# EAGLE design MSP430_6_8_19_REV1 (EAGLE 9.3.0)

## Sheet 1 of 2
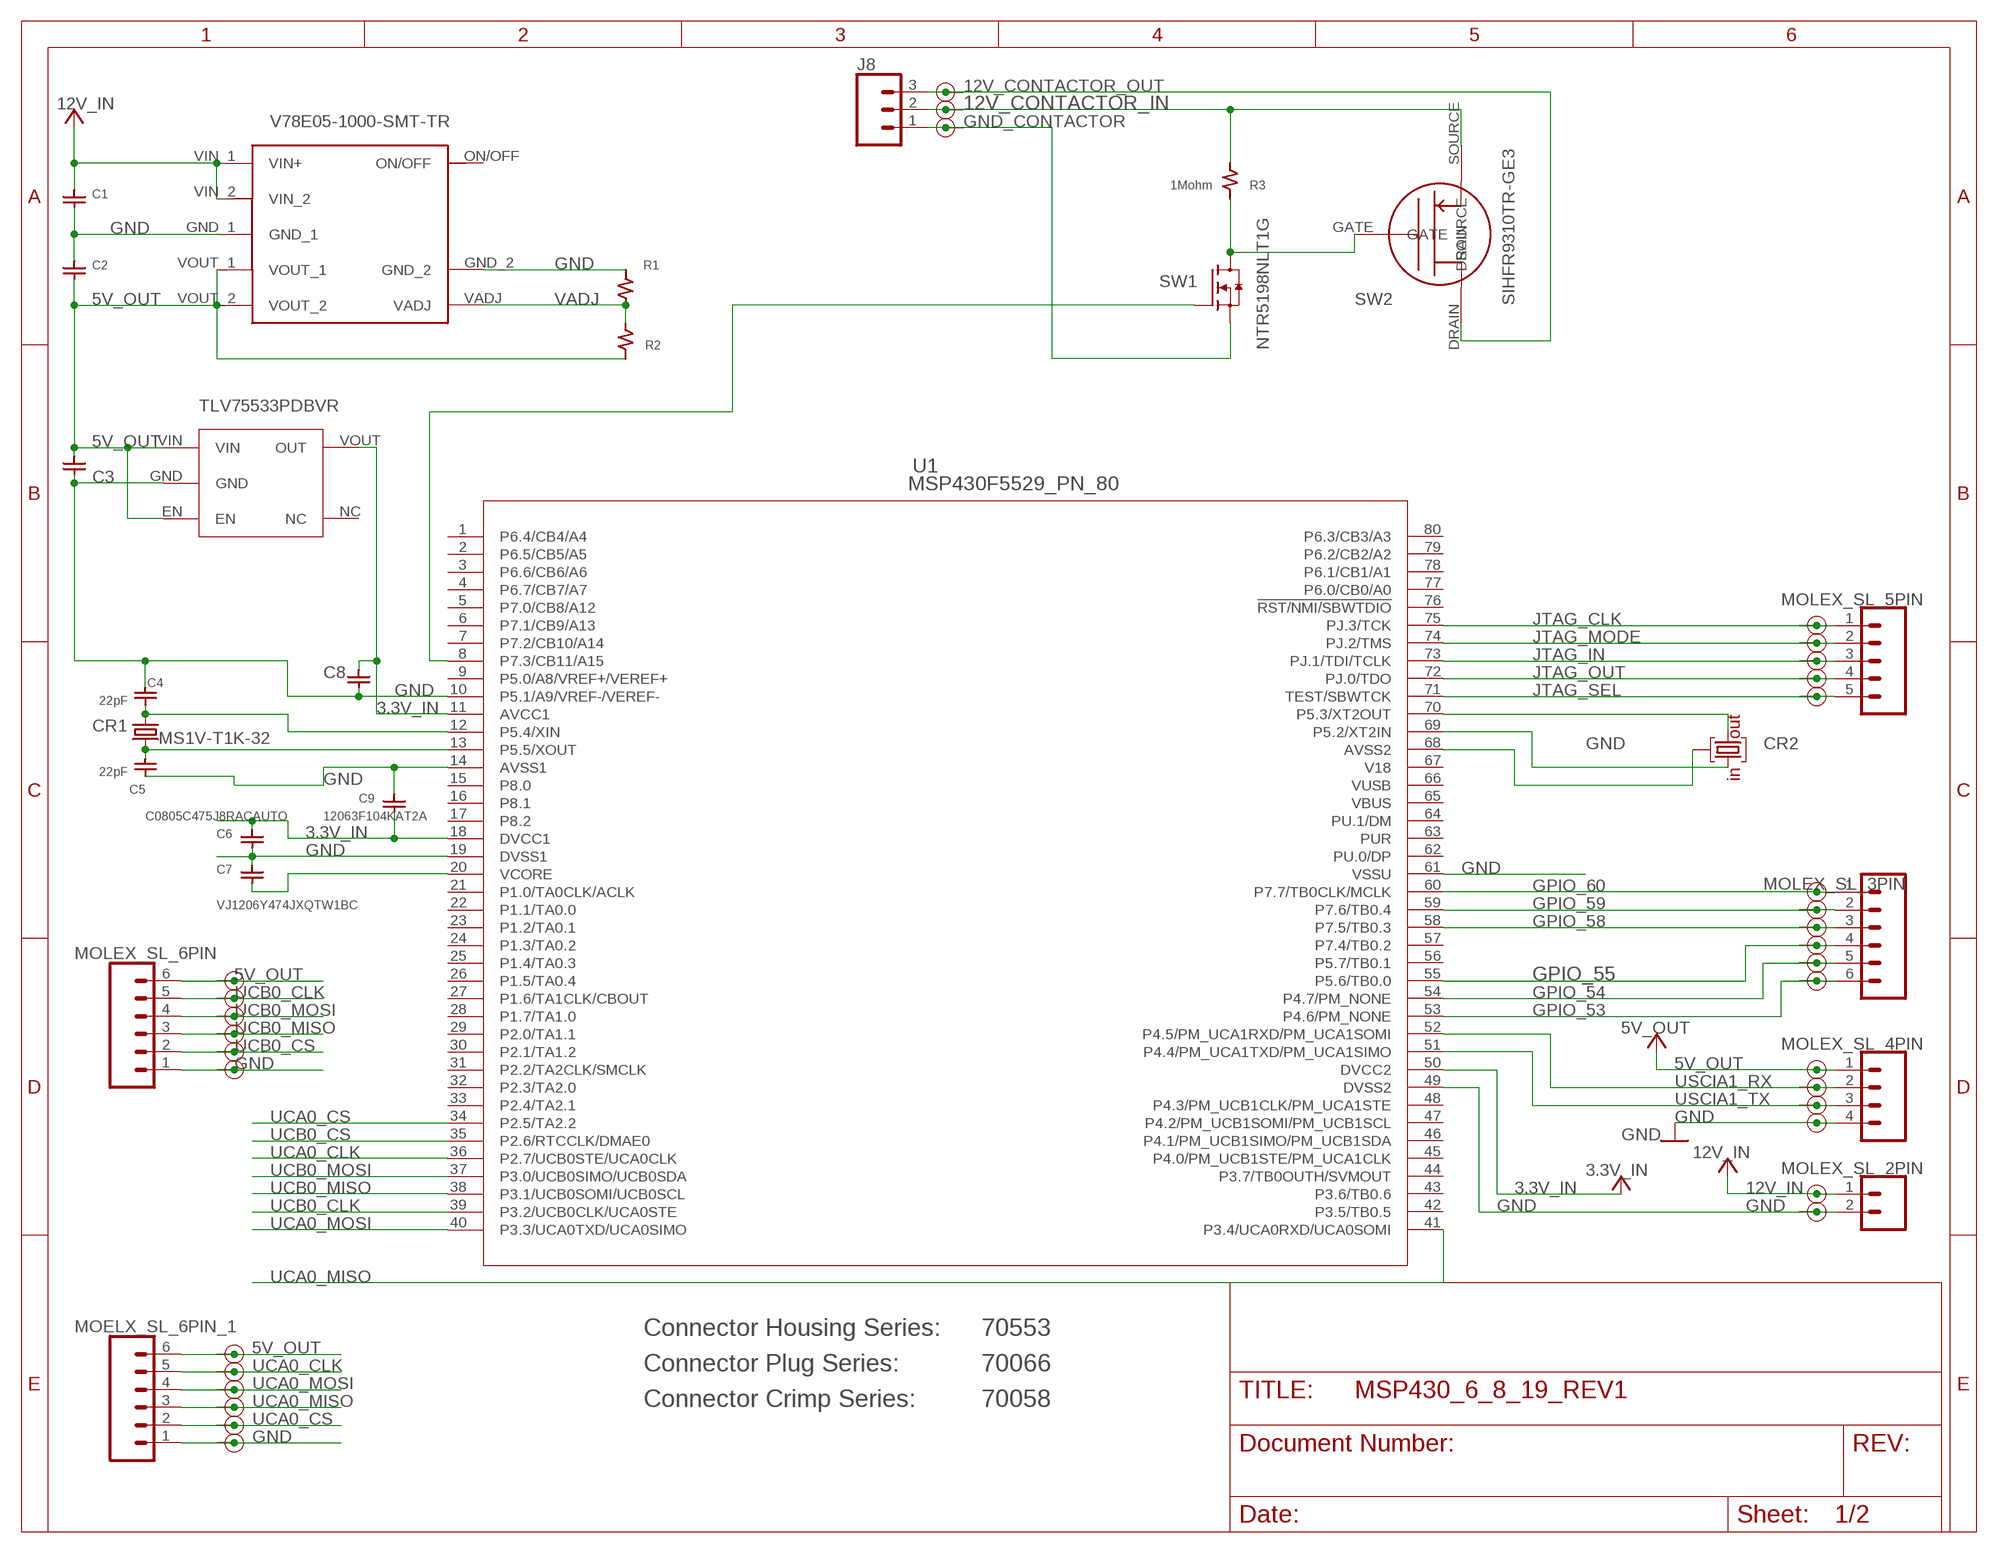
[diagram p0: schematic, sheet 1]

### Parts
C1  CGA5L1X7R1H106K160AC  [CGA5L1X7R1H106K160AC]
C2  C1206C226K8RACTU  [C1206C226K8RACTU]
C3  C0805C105J4RECTU  [C0805C105J4RECTU]
C4  22pF  C0805C220F5GACTUC0805C220F5GACTU  [C0805C220F5GACTU]
C5  22pF  C0805C220F5GACTUC0805C220F5GACTU  [C0805C220F5GACTU]
C6  C0805C475J8RACAUTO  [C0805C475J8RACAUTO]
C7  VJ1206Y474JXQTW1BC  [VJ1206Y474JXQTW1BC]
C8  C0805C105J4RECTU  [C0805C105J4RECTU]
C9  12063F104KAT2A  [12063F104KAT2A]
CR1  MS1V-T1K-32  [MS1V-T1K]
CR2  CSTCR4M00G53U-R0  [CSTCR4M00G53U-R0]
J8  CONN_03  [1X03]
MOELX_SL_6PIN_1  CONN_06SILK_FEMALE_PTH  [1X06]
MOLEX_SL_2PIN  CONN_02  [1X02]
MOLEX_SL_3PIN  CONN_06SILK_FEMALE_PTH  [1X06]
MOLEX_SL_4PIN  CONN_04  [1X04]
MOLEX_SL_5PIN  CONN_05  [1X05]
MOLEX_SL_6PIN  CONN_06SILK_FEMALE_PTH  [1X06]
PS1  V78E05-SMT-TR  [V78E05-1000-SMT-TR]
PS2  TLV75533PDBVR  [TLV75533PDBVR]
R1  RC2512FK-077K5L  [RC2512FK-077K5L]
R2  CRCW121043K0FKEAHP  [CRCW121043K0FKEAHP]
R3  1Mohm  THROUGHOLERESISTORCMF6023K000DHR6  [THROUGHHOLERESISTOR]
SW1  NTR5198NLT1G  [NTR5198NLT1G]
SW2  PMOS  [SIHFR9310TR-GE3]
U1  MSP430F5529_PN_80  [PN80]
U$10  HEADER_PIN_2.15/1.0  [2,15/1,0]
U$11  HEADER_PIN_2.15/1.0  [2,15/1,0]
U$12  HEADER_PIN_2.15/1.0  [2,15/1,0]
U$13  HEADER_PIN_2.15/1.0  [2,15/1,0]
U$14  HEADER_PIN_2.15/1.0  [2,15/1,0]
U$15  HEADER_PIN_2.15/1.0  [2,15/1,0]
U$16  HEADER_PIN_2.15/1.0  [2,15/1,0]
U$17  HEADER_PIN_2.15/1.0  [2,15/1,0]
U$18  HEADER_PIN_2.15/1.0  [2,15/1,0]
U$19  HEADER_PIN_2.15/1.0  [2,15/1,0]
U$20  HEADER_PIN_2.15/1.0  [2,15/1,0]
U$21  HEADER_PIN_2.15/1.0  [2,15/1,0]
U$22  HEADER_PIN_2.15/1.0  [2,15/1,0]
U$23  HEADER_PIN_2.15/1.0  [2,15/1,0]
U$24  HEADER_PIN_2.15/1.0  [2,15/1,0]
U$25  HEADER_PIN_2.15/1.0  [2,15/1,0]
U$26  HEADER_PIN_2.15/1.0  [2,15/1,0]
U$27  HEADER_PIN_2.15/1.0  [2,15/1,0]
U$28  HEADER_PIN_2.15/1.0  [2,15/1,0]
U$29  HEADER_PIN_2.15/1.0  [2,15/1,0]
U$30  HEADER_PIN_2.15/1.0  [2,15/1,0]
U$31  HEADER_PIN_2.15/1.0  [2,15/1,0]
U$32  HEADER_PIN_2.15/1.0  [2,15/1,0]
U$33  HEADER_PIN_2.15/1.0  [2,15/1,0]
U$34  HEADER_PIN_2.15/1.0  [2,15/1,0]
U$35  HEADER_PIN_2.15/1.0  [2,15/1,0]
U$36  HEADER_PIN_2.15/1.0  [2,15/1,0]
U$37  HEADER_PIN_2.15/1.0  [2,15/1,0]
U$38  HEADER_PIN_2.15/1.0  [2,15/1,0]
U$39  HEADER_PIN_2.15/1.0  [2,15/1,0]
U$40  HEADER_PIN_2.15/1.0  [2,15/1,0]
U$41  HEADER_PIN_2.15/1.0  [2,15/1,0]

### Nets
3.3V_IN: C6.2 C8.2 C9.1 PS2.VOUT(OUT) U1.11(AVCC1) U1.18(DVCC1) U1.50(DVCC2)
5V_OUT: C2.1 C3.2 MOELX_SL_6PIN_1.6 MOLEX_SL_4PIN.1 MOLEX_SL_6PIN.6 PS1.VOUT_1 PS1.VOUT_2 PS2.EN PS2.VIN R2.2 U$11.1 U$17.1 U$27.1 ; also sheet 2
12V_CONTACTOR_IN: J8.2 R3.1 SW2.SOURCE U$40.1
12V_CONTACTOR_OUT: J8.3 SW2.DRAIN U$39.1
12V_IN: C1.2 MOLEX_SL_2PIN.1 PS1.VIN_1(VIN+) PS1.VIN_2 U$23.1
GND: C1.1 C2.2 C3.1 C4.1 C5.2 C6.1 C7.2 C8.1 C9.2 CR2.GND MOELX_SL_6PIN_1.1 MOLEX_SL_2PIN.2 MOLEX_SL_4PIN.4 MOLEX_SL_6PIN.1 PS1.GND_1 PS1.GND_2 PS2.GND R1.2 U1.10(P5.1/A9/VREF-/VEREF-) U1.14(AVSS1) U1.19(DVSS1) U1.49(DVSS2) U1.61(VSSU) U1.68(AVSS2) U$10.1 U$16.1 U$22.1 U$24.1 ; also sheet 2
GND_CONTACTOR: J8.1 SW1.SOURCE U$41.1
GPIO_53: MOLEX_SL_3PIN.6 U1.53(P4.6/PM_NONE) U$28.1
GPIO_54: MOLEX_SL_3PIN.5 U1.54(P4.7/PM_NONE) U$29.1
GPIO_55: MOLEX_SL_3PIN.4 U1.55(P5.6/TB0.0) U$30.1
GPIO_58: MOLEX_SL_3PIN.3 U1.58(P7.5/TB0.3) U$31.1
GPIO_59: MOLEX_SL_3PIN.2 U1.59(P7.6/TB0.4) U$32.1
GPIO_60: MOLEX_SL_3PIN.1 U1.60(P7.7/TB0CLK/MCLK) U$33.1
JTAG_CLK: MOLEX_SL_5PIN.1 U1.75(PJ.3/TCK) U$38.1
JTAG_IN: MOLEX_SL_5PIN.3 U1.73(PJ.1/TDI/TCLK) U$36.1
JTAG_MODE: MOLEX_SL_5PIN.2 U1.74(PJ.2/TMS) U$37.1
JTAG_OUT: MOLEX_SL_5PIN.4 U1.72(PJ.0/TDO) U$35.1
JTAG_SEL: MOLEX_SL_5PIN.5 U1.71(TEST/SBWTCK) U$34.1
N$1: C7.1 U1.20(VCORE)
N$12: CR2.IN U1.69(P5.2/XT2IN)
N$13: CR2.OUT U1.70(P5.3/XT2OUT)
N$19: C4.2 CR1.P$2 U1.12(P5.4/XIN)
N$20: C5.1 CR1.P$3 U1.13(P5.5/XOUT)
N$30: R3.2 SW1.DRAIN SW2.GATE
N$31: SW1.GATE U1.8(P7.3/CB11/A15)
UCA0_CLK: MOELX_SL_6PIN_1.5 U1.36(P2.7/UCB0STE/UCA0CLK) U$18.1
UCA0_CS: MOELX_SL_6PIN_1.2 U1.34(P2.5/TA2.2) U$21.1
UCA0_MISO: MOELX_SL_6PIN_1.3 U1.41(P3.4/UCA0RXD/UCA0SOMI) U$20.1
UCA0_MOSI: MOELX_SL_6PIN_1.4 U1.40(P3.3/UCA0TXD/UCA0SIMO) U$19.1
UCB0_CLK: MOLEX_SL_6PIN.5 U1.39(P3.2/UCB0CLK/UCA0STE) U$12.1 ; also sheet 2
UCB0_CS: MOLEX_SL_6PIN.2 U1.35(P2.6/RTCCLK/DMAE0) U$15.1 ; also sheet 2
UCB0_MISO: MOLEX_SL_6PIN.3 U1.38(P3.1/UCB0SOMI/UCB0SCL) U$14.1 ; also sheet 2
UCB0_MOSI: MOLEX_SL_6PIN.4 U1.37(P3.0/UCB0SIMO/UCB0SDA) U$13.1 ; also sheet 2
USCIA1_RX: MOLEX_SL_4PIN.2 U1.52(P4.5/PM_UCA1RXD/PM_UCA1SOMI) U$26.1
USCIA1_TX: MOLEX_SL_4PIN.3 U1.51(P4.4/PM_UCA1TXD/PM_UCA1SIMO) U$25.1
VADJ: PS1.VADJ R1.1 R2.1
Unconnected: PS1.ON/OFF PS2.NC U1.1(P6.4/CB4/A4) U1.2(P6.5/CB5/A5) U1.3(P6.6/CB6/A6) U1.4(P6.7/CB7/A7) U1.5(P7.0/CB8/A12) U1.6(P7.1/CB9/A13) U1.7(P7.2/CB10/A14) U1.9(P5.0/A8/VREF+/VEREF+) U1.15(P8.0) U1.16(P8.1) U1.17(P8.2) U1.21(P1.0/TA0CLK/ACLK) U1.22(P1.1/TA0.0) U1.23(P1.2/TA0.1) U1.24(P1.3/TA0.2) U1.25(P1.4/TA0.3) U1.26(P1.5/TA0.4) U1.27(P1.6/TA1CLK/CBOUT) U1.28(P1.7/TA1.0) U1.29(P2.0/TA1.1) U1.30(P2.1/TA1.2) U1.31(P2.2/TA2CLK/SMCLK) U1.32(P2.3/TA2.0) U1.33(P2.4/TA2.1) U1.42(P3.5/TB0.5) U1.43(P3.6/TB0.6) U1.44(P3.7/TB0OUTH/SVMOUT) U1.45(P4.0/PM_UCB1STE/PM_UCA1CLK) U1.46(P4.1/PM_UCB1SIMO/PM_UCB1SDA) U1.47(P4.2/PM_UCB1SOMI/PM_UCB1SCL) U1.48(P4.3/PM_UCB1CLK/PM_UCA1STE) U1.56(P5.7/TB0.1) U1.57(P7.4/TB0.2) U1.62(PU.0/DP) U1.63(PUR) U1.64(PU.1/DM) U1.76(!RST/NMI/SBWTDIO) U1.77(P6.0/CB0/A0) U1.78(P6.1/CB1/A1) U1.79(P6.2/CB2/A2) U1.80(P6.3/CB3/A3)

### Notes on the sheet
- SW1
- SW2
- C3
- C8
- CR1
- CR2
- Connector Housing Series: | 70553
- Connector Plug Series: | 70066
- Connector Crimp Series: | 70058

## Sheet 2 of 2
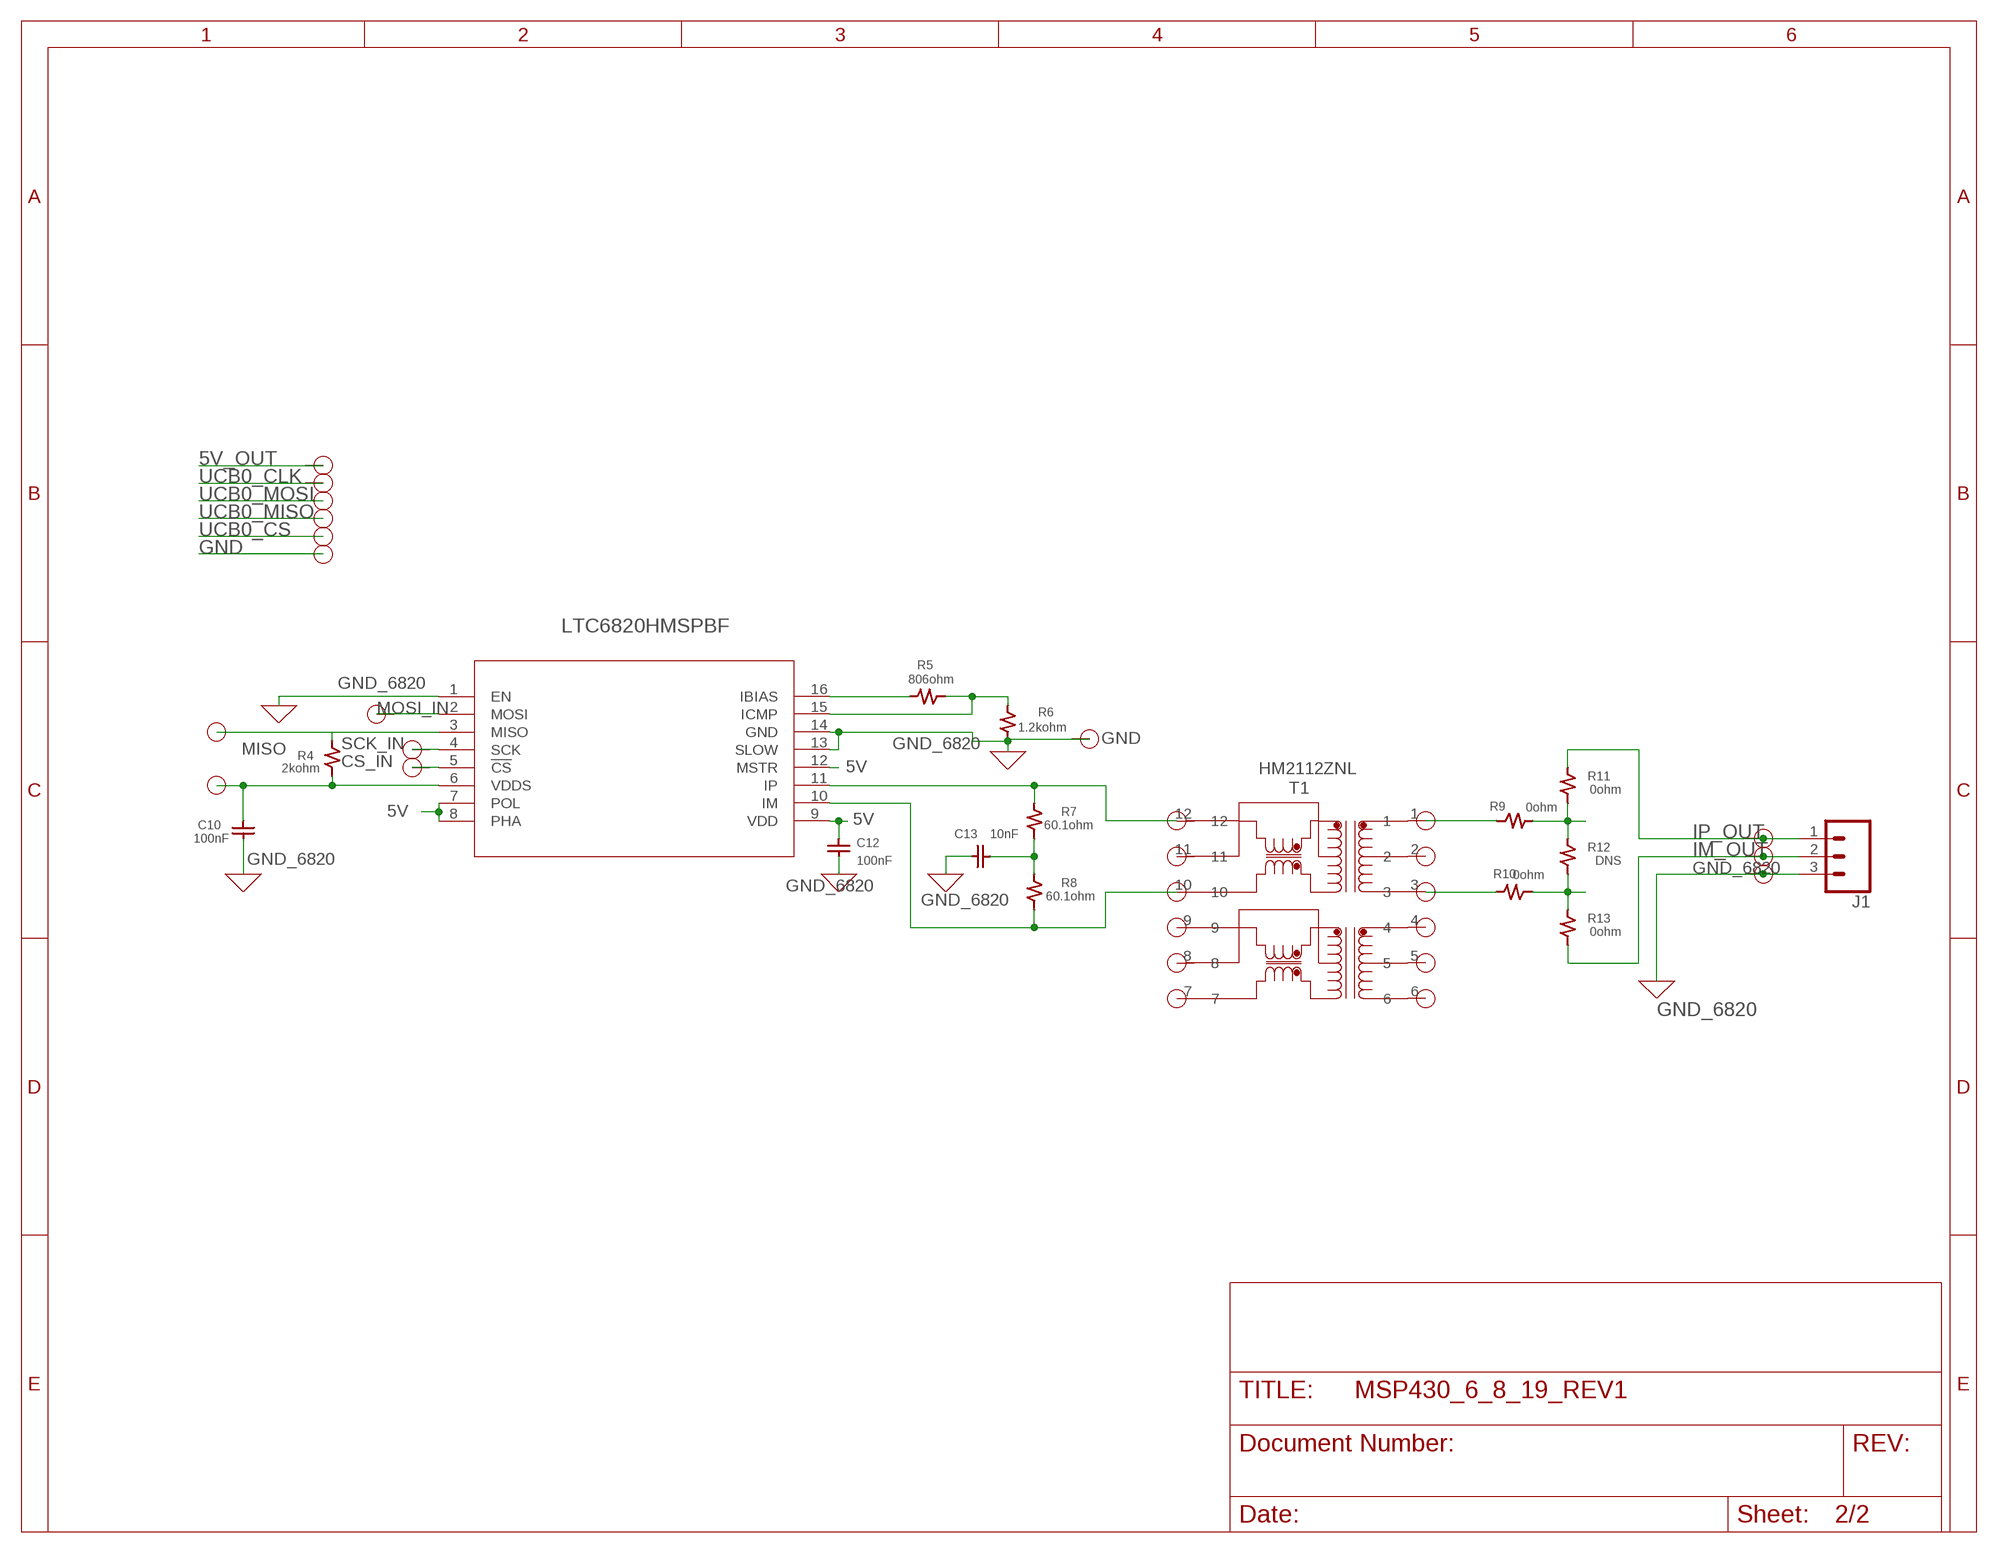
[diagram p1: schematic, sheet 2]

### Parts
+5V  HEADER_PIN_2.15/1.0  [2,15/1,0]
C10  100nF  0805_CAPACITOR  [0805_CAPACITOR]
C12  100nF  0805_CAPACITOR  [0805_CAPACITOR]
C13  10nF  0805_CAPACITOR  [0805_CAPACITOR]
CS  HEADER_PIN_2.15/1.0  [2,15/1,0]
GND  HEADER_PIN_2.15/1.0  [2,15/1,0]
J1  CONN_03  [1X03]
MISO  HEADER_PIN_2.15/1.0  [2,15/1,0]
MOSI  HEADER_PIN_2.15/1.0  [2,15/1,0]
R4  2kohm  0805_RESISTOR  [0805_RESISTOR]
R5  806ohm  0805_RESISTOR  [0805_RESISTOR]
R6  1.2kohm  0805_RESISTOR  [0805_RESISTOR]
R7  60.1ohm  0805_RESISTOR  [0805_RESISTOR]
R8  60.1ohm  0805_RESISTOR  [0805_RESISTOR]
R9  0ohm  0805_RESISTOR  [0805_RESISTOR]
R10  0ohm  0805_RESISTOR  [0805_RESISTOR]
R11  0ohm  0805_RESISTOR  [0805_RESISTOR]
R12  DNS  0805_RESISTOR  [0805_RESISTOR]
R13  0ohm  0805_RESISTOR  [0805_RESISTOR]
SCK  HEADER_PIN_2.15/1.0  [2,15/1,0]
T1  HM2112ZNL  [HM2112ZNL_12SMT]
U2  LTC6820HMSPBF  [MSOP-16_MS]
U$42  HEADER_PIN_2.15/1.0  [2,15/1,0]
U$43  HEADER_PIN_2.15/1.0  [2,15/1,0]
U$44  HEADER_PIN_2.15/1.0  [2,15/1,0]
U$45  HEADER_PIN_2.15/1.0  [2,15/1,0]
U$46  HEADER_PIN_2.15/1.0  [2,15/1,0]
U$47  HEADER_PIN_2.15/1.0  [2,15/1,0]
U$48  HEADER_PIN_2.15/1.0  [2,15/1,0]
U$49  HEADER_PIN_2.15/1.0  [2,15/1,0]
U$50  HEADER_PIN_2.15/1.0  [2,15/1,0]

### Nets
5V: +5V.1 C10.P$2 C12.P$2 R4.P$2 U2.6(VDDS) U2.7(POL) U2.8(PHA) U2.9(VDD) U2.12(MSTR)
5V_OUT: U$45.1 ; also sheet 1
CS_IN: CS.1 U2.5(!CS)
GND: U$50.1 ; also sheet 1
GND_6820: C10.P$1 C12.P$1 C13.P$1 GND.1 J1.3 R6.P$2 U2.1(EN) U2.13(SLOW) U2.14(GND) U$44.1 ; supply symbol labelled GND
IBIAS: R5.P$1 U2.16(IBIAS)
ICMP: R5.P$2 R6.P$1 U2.15(ICMP)
IM: R8.P$2 T1.10 U2.10(IM)
IM_OUT: J1.2 R13.P$2 U$43.1
IP: R7.P$1 T1.12 U2.11(IP)
IP_OUT: J1.1 R11.P$1 U$42.1
MISO_IN: MISO.1 R4.P$1 U2.3(MISO)
MOSI_IN: MOSI.1 U2.2(MOSI)
N$3: C13.P$2 R7.P$2 R8.P$1
N$11: R10.P$1 T1.3
N$21: R9.P$2 T1.1
N$40: R10.P$2 R12.P$2 R13.P$1
N$41: R9.P$1 R11.P$2 R12.P$1
SCK_IN: SCK.1 U2.4(SCK)
UCB0_CLK: U$46.1 ; also sheet 1
UCB0_CS: U$49.1 ; also sheet 1
UCB0_MISO: U$48.1 ; also sheet 1
UCB0_MOSI: U$47.1 ; also sheet 1
Unconnected: T1.2 T1.4 T1.5 T1.6 T1.7 T1.8 T1.9 T1.11

## Power pins joined to a net without a drawn wire
V18: U1.67(V18)
VBUS: U1.65(VBUS)
VUSB: U1.66(VUSB)

## Library data of the parts
+5V CS GND MISO MOSI SCK U$10-U$50 = Library_Capstone:HEADER_PIN_2.15/1.0
C1 = Library_Capstone:CGA5L1X7R1H106K160AC
C2 = Library_Capstone:C1206C226K8RACTU
C3 C8 = Library_Capstone:C0805C105J4RECTU
C4 C5 = Library_Capstone:C0805C220F5GACTU
C6 = Library_Capstone:C0805C475J8RACAUTO
C7 = Library_Capstone:VJ1206Y474JXQTW1BC
C9 = Library_Capstone:12063F104KAT2A
C10 C12 C13 = Library_Capstone:0805_CAPACITOR; MPN: MC0805B104K160CT; OC_NEWARK: 06R3738
CR1 = Library_Capstone:MS1V-T1K-32
CR2 = Library_Capstone:CSTCR4M00G53U-R0
J1 J8 = SparkFun-Connectors:CONN_03: Multi connection point. Often used as Generic Header-pin footprint for 0.1 inch spaced/style header connections On any of the 0.1 inch spaced packages, you can populate with these: Break Away Headers - Straight <https://www.sparkfun.com/products/116> (PRT-00116) Break Away Male Headers - Right Angle <https://www.sparkfun.com/products/553> (PRT-00553) Female Headers <https://www.sparkfun.com/products/115> (PRT-00115) Break Away Headers - Machine Pin <https://www.sparkfun.com/products/117> (PRT-00117) Break Away Female Headers - Swiss Machine Pin <https://www.sparkfun.com/products/743> (PRT-00743) Stackable Header - 3 Pin (Female, 0.1") <https://www.sparkfun.com/products/13875> (PRT-13875) For SCREWTERMINALS and SPRING TERMINALS visit here: Screw Terimnals on SparkFun.com <https://www.sparkfun.com/search/results?term=Screw+Terminals> (5mm/3.5mm/2.54mm spacing) This device is also useful as a general connection point to wire up your design to another part of your project. Our various solder wires solder well into these plated through hole pads. Hook-Up Wire - Assortment (Stranded, 22 AWG) <https://www.sparkfun.com/products/11375> (PRT-11375) Hook-Up Wire - Assortment (Solid Core, 22 AWG) <https://www.sparkfun.com/products/11367> (PRT-11367) View the entire wire category on our website here <https://www.sparkfun.com/categories/141> Special notes: Molex polarized connector foot print use with SKU : PRT-08232 with associated crimp pins and housings.
MOELX_SL_6PIN_1 MOLEX_SL_3PIN MOLEX_SL_6PIN = SparkFun-Connectors:CONN_06: Multi connection point. Often used as Generic Header-pin footprint for 0.1 inch spaced/style header connections On any of the 0.1 inch spaced packages, you can populate with these: Break Away Headers - Straight <https://www.sparkfun.com/products/116> (PRT-00116) Break Away Male Headers - Right Angle <https://www.sparkfun.com/products/553> (PRT-00553) Female Headers <https://www.sparkfun.com/products/115> (PRT-00115) Break Away Headers - Machine Pin <https://www.sparkfun.com/products/117> (PRT-00117) Break Away Female Headers - Swiss Machine Pin <https://www.sparkfun.com/products/743> (PRT-00743) Arduino Stackable Header - 6 Pin <https://www.sparkfun.com/products/9280> (PRT-09280) For SCREWTERMINALS and SPRING TERMINALS visit here: Screw Terimnals on SparkFun.com <https://www.sparkfun.com/search/results?term=Screw+Terminals> (5mm/3.5mm/2.54mm spacing) This device is also useful as a general connection point to wire up your design to another part of your project. Our various solder wires solder well into these plated through hole pads. Hook-Up Wire - Assortment (Stranded, 22 AWG) <https://www.sparkfun.com/products/11375> (PRT-11375) Hook-Up Wire - Assortment (Solid Core, 22 AWG) <https://www.sparkfun.com/products/11367> (PRT-11367) View the entire wire category on our website here <https://www.sparkfun.com/categories/141>; PROD_ID: CONN-08437
MOLEX_SL_2PIN = SparkFun-Connectors:CONN_02: Multi connection point. Often used as Generic Header-pin footprint for 0.1 inch spaced/style header connections On any of the 0.1 inch spaced packages, you can populate with these: Break Away Headers - Straight <https://www.sparkfun.com/products/116> (PRT-00116) Break Away Male Headers - Right Angle <https://www.sparkfun.com/products/553> (PRT-00553) Female Headers <https://www.sparkfun.com/products/115> (PRT-00115) Break Away Headers - Machine Pin <https://www.sparkfun.com/products/117> (PRT-00117) Break Away Female Headers - Swiss Machine Pin <https://www.sparkfun.com/products/743> (PRT-00743) For SCREWTERMINALS and SPRING TERMINALS visit here: Screw Terimnals on SparkFun.com <https://www.sparkfun.com/search/results?term=Screw+Terminals> (5mm/3.5mm/2.54mm spacing) This device is also useful as a general connection point to wire up your design to another part of your project. Our various solder wires solder well into these plated through hole pads. Hook-Up Wire - Assortment (Stranded, 22 AWG) <https://www.sparkfun.com/products/11375> (PRT-11375) Hook-Up Wire - Assortment (Solid Core, 22 AWG) <https://www.sparkfun.com/products/11367> (PRT-11367) View the entire wire category on our website here <https://www.sparkfun.com/categories/141> Special notes: Molex polarized connector foot print use with: PRT-08233 with associated crimp pins and housings. 2.54_SCREWTERM for use with PRT-10571. 3.5mm Screw Terminal footprints for PRT-08084 5mm Screw Terminal footprints for use with PRT-08432
MOLEX_SL_4PIN = SparkFun-Connectors:CONN_04: Multi connection point. Often used as Generic Header-pin footprint for 0.1 inch spaced/style header connections On any of the 0.1 inch spaced packages, you can populate with these: Break Away Headers - Straight <https://www.sparkfun.com/products/116> (PRT-00116) Break Away Male Headers - Right Angle <https://www.sparkfun.com/products/553> (PRT-00553) Female Headers <https://www.sparkfun.com/products/115> (PRT-00115) Break Away Headers - Machine Pin <https://www.sparkfun.com/products/117> (PRT-00117) Break Away Female Headers - Swiss Machine Pin <https://www.sparkfun.com/products/743> (PRT-00743) For SCREWTERMINALS and SPRING TERMINALS visit here: Screw Terimnals on SparkFun.com <https://www.sparkfun.com/search/results?term=Screw+Terminals> (5mm/3.5mm/2.54mm spacing) This device is also useful as a general connection point to wire up your design to another part of your project. Our various solder wires solder well into these plated through hole pads. Hook-Up Wire - Assortment (Stranded, 22 AWG) <https://www.sparkfun.com/products/11375> (PRT-11375) Hook-Up Wire - Assortment (Solid Core, 22 AWG) <https://www.sparkfun.com/products/11367> (PRT-11367) View the entire wire category on our website here <https://www.sparkfun.com/categories/141> Special notes: Molex polarized connector foot print use with SKU : PRT-08231 with associated crimp pins and housings. 1MM SMD Version SKU: PRT-10208; PROD_ID: CONN-09696
MOLEX_SL_5PIN = SparkFun-Connectors:CONN_05: Multi connection point. Often used as Generic Header-pin footprint for 0.1 inch spaced/style header connections On any of the 0.1 inch spaced packages, you can populate with these: Break Away Headers - Straight <https://www.sparkfun.com/products/116> (PRT-00116) Break Away Male Headers - Right Angle <https://www.sparkfun.com/products/553> (PRT-00553) Female Headers <https://www.sparkfun.com/products/115> (PRT-00115) Break Away Headers - Machine Pin <https://www.sparkfun.com/products/117> (PRT-00117) Break Away Female Headers - Swiss Machine Pin <https://www.sparkfun.com/products/743> (PRT-00743) For SCREWTERMINALS and SPRING TERMINALS visit here: Screw Terimnals on SparkFun.com <https://www.sparkfun.com/search/results?term=Screw+Terminals> (5mm/3.5mm/2.54mm spacing) This device is also useful as a general connection point to wire up your design to another part of your project. Our various solder wires solder well into these plated through hole pads. Hook-Up Wire - Assortment (Stranded, 22 AWG) <https://www.sparkfun.com/products/11375> (PRT-11375) Hook-Up Wire - Assortment (Solid Core, 22 AWG) <https://www.sparkfun.com/products/11367> (PRT-11367) View the entire wire category on our website here <https://www.sparkfun.com/categories/141> Special notes: Molex polarized connector foot print use with SKU : PRT-08231 with associated crimp pins and housings. 1MM SMD Version SKU: PRT-10208
PS1 = Library_Capstone:V78E05-SMT-TR
PS2 = Library_Capstone:TLV75533PDBVR
R1 = Library_Capstone:RC2512FK-077K5L
R2 = Library_Capstone:CRCW121043K0FKEAHP
R3 = Library_Capstone:THROUGHOLERESISTOR
R4 = Library_Capstone:0805_RESISTOR; MPN: ERJ-6ENF2001V; OC_NEWARK: 65T8715
R5 = Library_Capstone:0805_RESISTOR; MF: VISHAY/DALE; MPN: CRCW0805806RFKEA; OC_NEWARK: 53K0501
R6 = Library_Capstone:0805_RESISTOR; MPN: MC0805S8F1201T5E; OC_NEWARK: 04P0558
R7-R13 = Library_Capstone:0805_RESISTOR; MF: BOURNS, INC.; MPN: CR0805-FX-1200GLF; OC_NEWARK: 32K2808
SW1 = Library_Capstone:NTR5198NLT1G
SW2 = Library_Capstone:PMOS
T1 = Library_Capstone:HM2112ZNL
U1 = MSP430f5529:MSP430F5529_PN_80; MANUFACTURER_PART_NUMBER: MSP430F5529_PN_80; VENDOR: Texas Instruments
U2 = 6820_MSOP-16_MS-M:LTC6820HMSPBF; MANUFACTURER_PART_NUMBER: LTC6820HMS#PBF; OC_NEWARK: unknown; VENDOR: Linear Technology

## Board
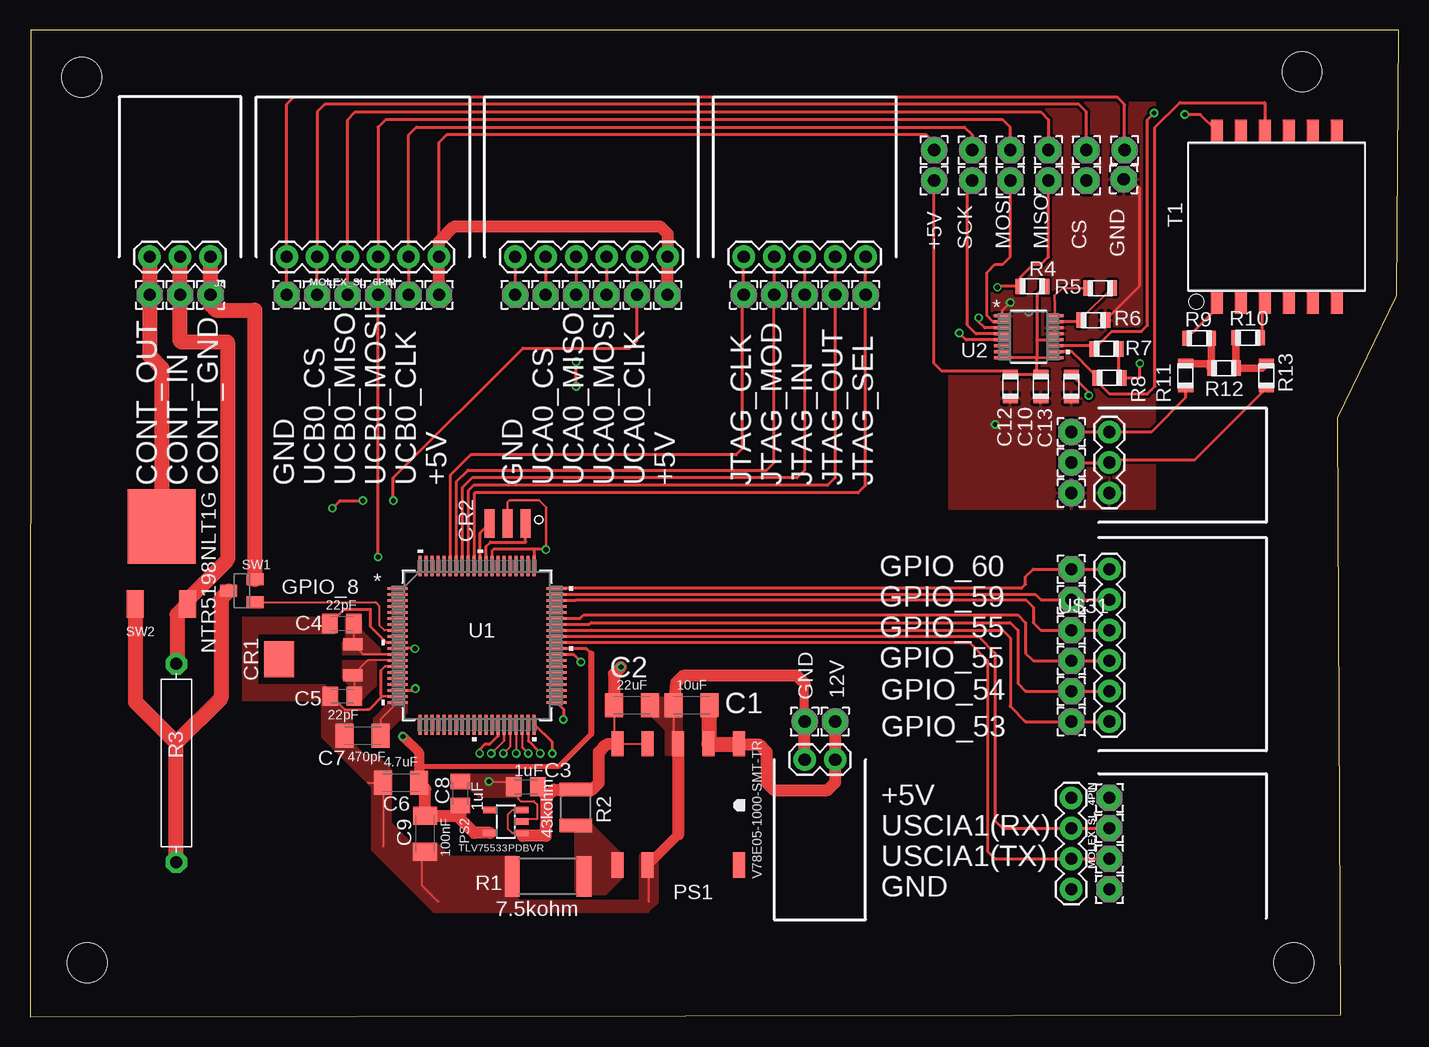
[diagram p2: board, top side]
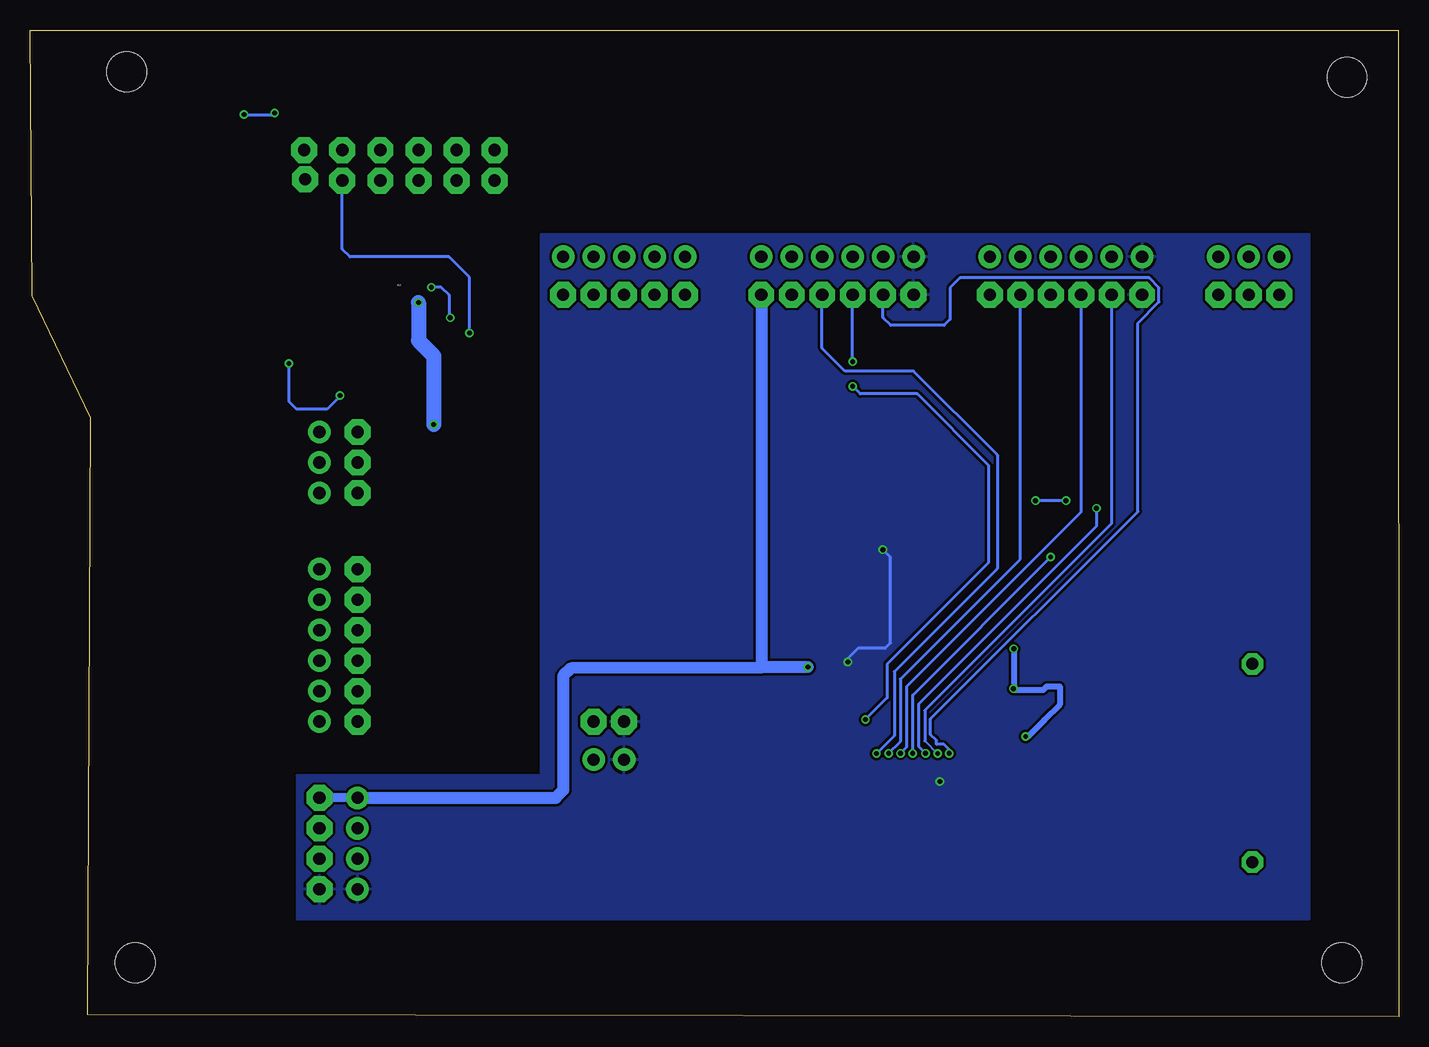
[diagram p3: board, bottom side, seen from below]

Size 114.11 x 82.23 mm. Coordinates in mm from the lower left corner, seen from the top.
Outline: 0,0 109.28,0.19 109.03,49.91 113.92,60.07 114.11,82.23 0.06,82.23 0,0
Copper layers (1*16): Top 0.035mm / dielectric 1.5mm / Bottom 0.035mm
Design rules "sierraDRC_main *": minimum track width 6mil, minimum drill 15mil, track to track 8mil, track to pad 8mil, pad to pad 8mil, via to via 8mil, smd to smd 8mil, copper to edge 40mil, drill to drill 10mil, minimum pad ring 10mil, minimum via ring 6mil, stop-mask expansion 5mil, vias tented up to drill 0mil, thermal gap 10mil
Holes 3.3 mm at 106.04,78.74 105.35,4.51 4.76,4.51 4.32,78.3

### Footprints (pad centres in the part's own frame; a part is rotated, then mirrored left to right if it is on the bottom)
2,15/1,0 = drill 1.016 pad 2.159 octagon: 1 0,0
CGA5L1X7R1H106K160AC = smd 1.5 x 2: 1 -1.5,0; 2 1.5,0
C1206C226K8RACTU = smd 1.5 x 2: 1 -1.5,0; 2 1.5,0
C0805C105J4RECTU = smd 1.3 x 1.6: 1 -1,0; 2 1,0
C0805C220F5GACTU = smd 1.3 x 1.6: 1 -1,0; 2 1,0
C0805C475J8RACAUTO = smd 1.5 x 2: 1 -1.5,0; 2 1.5,0
VJ1206Y474JXQTW1BC = smd 1.5 x 2: 1 -1.5,0; 2 1.5,0
12063F104KAT2A = smd 1.5 x 2: 1 -1.5,0; 2 1.5,0
0805_CAPACITOR = smd 0.8 x 1.27: P$1 -1,0; P$2 1,0
MS1V-T1K = smd 2.5 x 3: P$1 -1.24,0.03 | smd 1.6 x 1: P$2 4.9,1.3; P$3 4.9,-1.3
CSTCR4M00G53U-R0 = smd 0.8 x 2.4: GND 0,0; IN 1.5,0; OUT -1.5,0
1X03 = drill 1.016 pad 1.88: 1 0,0; 2 2.54,0; 3 5.08,0
1X06 = drill 1.016 pad 1.88: 1 0,0; 2 2.54,0; 3 5.08,0; 4 7.62,0; 5 10.16,0; 6 12.7,0
1X02 = drill 1.016 pad 1.88: 1 0,0; 2 2.54,0
1X04 = drill 1.016 pad 1.88: 1 0,0; 2 2.54,0; 3 5.08,0; 4 7.62,0
1X05 = drill 1.016 pad 1.88: 1 0,0; 2 2.54,0; 3 5.08,0; 4 7.62,0; 5 10.16,0
V78E05-1000-SMT-TR = smd 1 x 2.1: GND_1 2.54,5.05; GND_2 0,-5.05; ON/OFF -5.08,5.05; VADJ 5.08,5.05; VIN_1 -5.08,-5.05; VIN_2 -2.54,-5.05; VOUT_1 2.54,-5.05; VOUT_2 5.08,-5.05
TLV75533PDBVR = smd 0.55 x 1.2: EN 0.95,-1.3; GND 0,-1.3; NC 0.95,1.3; VIN -0.95,-1.3; VOUT -0.95,1.3
RC2512FK-077K5L = smd 1.22 x 3.35: 1 -2.99,0; 2 2.99,0
CRCW121043K0FKEAHP = smd 1.12 x 2.7: 1 -1.49,0; 2 1.49,0
THROUGHHOLERESISTOR = drill 1 pad 1.778 octagon: 1 -5.08,0; 2 11.43,0
0805_RESISTOR = smd 0.8 x 1.27: P$1 -1,0; P$2 1,0
NTR5198NLT1G = smd 1 x 1.4: DRAIN 0,1.1; GATE -0.95,-1.1; SOURCE 0.95,-1.1
SIHFR9310TR-GE3 = smd 5.69 x 6.172: DRAIN 0,3.099 | smd 1.397 x 2.286: GATE -2.21,-3.353; SOURCE 2.159,-3.353
HM2112ZNL_12SMT = smd 1.02 x 1.89: 1 0,-7.145; 2 2,-7.145; 3 4,-7.145; 4 6,-7.145; 5 8,-7.145; 6 10,-7.145; 7 10,7.145; 8 8,7.145; 9 6,7.145; 10 4,7.145; 11 2,7.145; 12 0,7.145
PN80 = smd 1.676 x 0.229: 1 -6.617,4.75; 2 -6.617,4.25; 3 -6.617,3.75; 4 -6.617,3.25; 5 -6.617,2.75; 6 -6.617,2.25; 7 -6.617,1.75; 8 -6.617,1.25; 9 -6.617,0.75; 10 -6.617,0.25; 11 -6.617,-0.25; 12 -6.617,-0.75; 13 -6.617,-1.25; 14 -6.617,-1.75; 15 -6.617,-2.25; 16 -6.617,-2.75; 17 -6.617,-3.25; 18 -6.617,-3.75; 19 -6.617,-4.25; 20 -6.617,-4.75; 41 6.617,-4.75; 42 6.617,-4.25; 43 6.617,-3.75; 44 6.617,-3.25; 45 6.617,-2.75; 46 6.617,-2.25; 47 6.617,-1.75; 48 6.617,-1.25; 49 6.617,-0.75; 50 6.617,-0.25; 51 6.617,0.25; 52 6.617,0.75; 53 6.617,1.25; 54 6.617,1.75; 55 6.617,2.25; 56 6.617,2.75; 57 6.617,3.25; 58 6.617,3.75; 59 6.617,4.25; 60 6.617,4.75 | smd 0.229 x 1.676: 21 -4.75,-6.617; 22 -4.25,-6.617; 23 -3.75,-6.617; 24 -3.25,-6.617; 25 -2.75,-6.617; 26 -2.25,-6.617; 27 -1.75,-6.617; 28 -1.25,-6.617; 29 -0.75,-6.617; 30 -0.25,-6.617; 31 0.25,-6.617; 32 0.75,-6.617; 33 1.25,-6.617; 34 1.75,-6.617; 35 2.25,-6.617; 36 2.75,-6.617; 37 3.25,-6.617; 38 3.75,-6.617; 39 4.25,-6.617; 40 4.75,-6.617; 61 4.75,6.617; 62 4.25,6.617; 63 3.75,6.617; 64 3.25,6.617; 65 2.75,6.617; 66 2.25,6.617; 67 1.75,6.617; 68 1.25,6.617; 69 0.75,6.617; 70 0.25,6.617; 71 -0.25,6.617; 72 -0.75,6.617; 73 -1.25,6.617; 74 -1.75,6.617; 75 -2.25,6.617; 76 -2.75,6.617; 77 -3.25,6.617; 78 -3.75,6.617; 79 -4.25,6.617; 80 -4.75,6.617
MSOP-16_MS = smd 1.397 x 0.229: 1 -2.184,1.751; 2 -2.184,1.251; 3 -2.184,0.751; 4 -2.184,0.25; 5 -2.184,-0.25; 6 -2.184,-0.751; 7 -2.184,-1.251; 8 -2.184,-1.751; 9 2.184,-1.751; 10 2.184,-1.251; 11 2.184,-0.751; 12 2.184,-0.25; 13 2.184,0.25; 14 2.184,0.751; 15 2.184,1.251; 16 2.184,1.751

### Placement (x,y rotation side)
+5V  75.37,69.68 180 top
C1  55.16,25.97 0 top
C2  50.18,25.97 0 top
C3  41.34,19.16 0 top
C4  26,32.78 0 top
C5  26.05,26.71 180 top
C6  30.92,19.52 0 top
C7  27.75,23.41 180 top
C8  35.88,18.61 270 top
C9  32.96,15.25 270 top
C10  84.26,52.54 90 top
C12  81.72,52.54 90 top
C13  86.8,52.54 90 top
CR1  22.01,29.76 0 top
CR2  39.81,41.11 0 top
CS  88.07,69.68 180 top
GND  91.17,69.79 270 top
J1  89.98,48.73 270 top
J8  15.05,63.33 180 top
MISO  84.9,69.68 180 top
MOELX_SL_6PIN_1  40.45,63.33 0 top
MOLEX_SL_2PIN  67.12,21.42 180 top
MOLEX_SL_3PIN  89.98,37.3 270 top
MOLEX_SL_4PIN  86.8,18.25 270 top
MOLEX_SL_5PIN  59.5,63.33 0 top
MOLEX_SL_6PIN  21.4,63.33 0 top
MOSI  81.72,69.68 180 top
PS1  54.04,17.69 180 top
PS2  39.66,16.27 90 top
R1  43.19,11.7 180 top
R2  45.5,17.44 90 top
R3  12.2,24.32 270 top
R4  83.57,60.86 0 top
R5  89.22,60.73 0 top
R6  88.65,58.06 0 top
R7  89.73,55.65 0 top
R8  89.98,53.24 180 top
R9  97.47,56.55 180 top
R10  101.54,56.58 180 top
R11  96.33,53.43 90 top
R12  99.53,54.06 0 top
R13  103.06,53.43 270 top
SCK  78.55,69.68 180 top
SW1  17.67,35.5 90 top
SW2  10.99,37.76 0 top
T1  98.93,66.67 0 top
U1  37.27,30.95 0 top
U2  83.25,56.67 0 top
U$10  89.98,10.63 180 top
U$11  34.1,60.16 270 top
U$12  31.56,60.16 90 top
U$13  29.02,60.16 270 top
U$14  26.48,60.16 270 top
U$15  23.94,60.16 180 top
U$16  21.4,60.16 0 top
U$17  53.15,60.16 270 top
U$18  50.61,60.16 270 top
U$19  48.07,60.16 270 top
U$20  45.53,60.16 270 top
U$21  42.99,60.16 270 top
U$22  40.45,60.16 270 top
U$23  67.12,24.6 90 top
U$24  64.58,24.6 90 top
U$25  89.98,13.17 180 top
U$26  89.98,15.71 180 top
U$27  89.98,18.25 180 top
U$28  86.8,24.6 0 top
U$29  86.8,27.14 0 top
U$30  86.8,29.68 0 top
U$31  86.8,32.22 0 top
U$32  86.8,34.76 180 top
U$33  86.8,37.3 180 top
U$34  69.66,60.16 270 top
U$35  67.12,60.16 270 top
U$36  64.58,60.16 270 top
U$37  62.04,60.16 270 top
U$38  59.5,60.16 270 top
U$39  9.97,60.16 90 top
U$40  12.51,60.16 90 top
U$41  15.05,60.16 90 top
U$42  86.8,48.73 90 top
U$43  86.8,46.19 90 top
U$44  86.8,43.65 90 top
U$45  75.37,72.22 180 top
U$46  78.55,72.22 180 top
U$47  81.72,72.22 180 top
U$48  84.9,72.22 180 top
U$49  88.07,72.22 180 top
U$50  91.25,72.22 180 top

### Tracks (layer width: path | path; a pad name or v marks a point on that pad's centre or on a via)
3.3V_IN  (via drill 0.4)
  Top 0.152: 43.92,30.67 U1.50
  Top 0.203: 32.42,20.26 C6.2 | 30.75,30.7 U1.11
  Top 0.254: v32.09,30.67 32.06,30.7 30.75,30.7 | v32.12,27.34 31.97,27.19 U1.18 | 46.8,30.26 46.39,30.67 43.92,30.67
  Top 0.406: 32.42,20.89 44.11,20.89 46.8,23.58
  Top 0.508: 46.8,23.58 46.8,30.26
  Top 0.813: v31.1,23.36 32.42,22.03 32.42,20.89 32.42,20.26
  Top 1.016: PS2.VOUT 37.03,15.32 35.88,16.47 | 35.88,16.47 C8.2 | 35.88,16.47 35.6,16.75 C9.1 32.96,18.99 C6.2
  Bottom 0.203: 28.44,27.53 28.27,27.53 | 29.53,24.75 29.55,24.73
  Bottom 0.508: v32.09,30.67 32.09,27.37 v32.12,27.34 32.02,27.24 29.63,27.24 29.35,27.53 28.44,27.53 | 28.27,27.53 28.27,26.01 29.53,24.75 | 29.55,24.73 30.92,23.36 v31.1,23.36
5V
  Top 0.203: U2.9 84.04,54.92
  Top 0.254: 84.04,54.92 83.93,54.81 83.93,56.42 | U2.6 U2.7 U2.8 83.88,54.92 83.88,53.92 C10.P$2 C12.P$2 81.45,53.81 76.01,53.81 75.37,54.44 +5V.1 | 83.93,56.42 83.93,60.22 R4.P$2 | 83.93,56.42 U2.12
5V_OUT  (via drill 0.4)
  Top 0.152: PS1.VOUT_2 49.06,22.74 | 49.06,22.74 PS1.VOUT_1 | C2.1 48.68,23.12 49.06,22.74 | PS2.EN 40.21,17.22 39.81,16.83 39.81,15.68 40.18,15.32 PS2.VIN
  Top 0.254: U$45.1 75.37,72.86 74.74,73.49 34.73,73.49 34.1,72.86 34.1,64.6 | 41.08,15.07 40.96,15.2 PS2.VIN
  Top 1.016: v49.26,29.15 48.68,28.56 C2.1 | U$11.1 MOLEX_SL_6PIN.6 34.1,64.6 35.37,65.87 52.51,65.87 53.15,65.24 MOELX_SL_6PIN_1.6 U$17.1 | C3.2 43.04,18.46 | 43.04,18.46 43.04,16.12 42.99,16.07 42.99,15.07 41.08,15.07 | PS1.VOUT_2 48.91,22.69 48.07,22.69 47.43,22.06 47.43,19.52 46.8,18.88 45.55,18.88 R2.2 43.67,18.93 43.2,18.46 43.04,18.46
  Bottom 0.762: MOLEX_SL_4PIN.1 U$27.1
  Bottom 1.016: v49.26,29.15 53.15,29.13 53.15,29.11 | MOLEX_SL_4PIN.1 70.29,18.25 69.66,18.88 69.66,28.41 69.02,29.04 53.15,29.1 53.15,29.11 | U$17.1 53.15,29.11
12V_CONTACTOR_IN
  Top 1.27: J8.2 U$40.1 12.51,56.35 12.64,56.22 16.47,56.22 16.47,38.09 13.14,34.76 SW2.SOURCE 12.26,33.52 12.26,29.51 12.22,29.42 R3.1
12V_CONTACTOR_OUT
  Top 1.27: J8.3 U$39.1 9.97,55.08 10.99,54.06 SW2.DRAIN
12V_IN
  Top 1.016: U$23.1 MOLEX_SL_2PIN.1 67.12,19.52 66.48,18.88 62.04,18.88 61.4,19.52 61.4,22.06 60.77,22.69 59.16,22.69 PS1.VIN_1
  Top 1.27: C1.2 56.66,22.82 PS1.VIN_2 56.62,22.69 59.16,22.69
CS_IN  (via drill 0.4)
  Top 0.254: U2.5 78.04,56.42 v77.47,56.98
  Bottom 0.254: CS.1 88.07,63.97 87.44,63.33 79.18,63.33 77.47,61.62 v77.47,56.98
GND  (via drill 0.4)
  Top 0.152: 28.15,19.52 C6.1 29.42,14.19 | U1.10 29.83,31.2 | 51.61,12.75 PS1.GND_1 51.6,12.54 51.6,9.59 | 34.02,9.59 32.65,10.96 32.65,13.45 C9.2 | C1.1 53.66,25.87 53.66,23.12 PS1.GND_2 | 43.04,39 43.04,38.95 v43.01,38.93 | U1.61 42.02,37.93 42.02,37.94 | U1.61 | v38.27,19.61 39.9,19.61 C3.1 40.68,18.82 40.68,18.17 40.88,17.97 42,17.97 42.25,17.72 42.25,16.45 41.14,16.45 PS2.GND
  Top 0.203: 42.02,38.98 42.04,38.99 42.02,39 | v43.01,38.93 43.01,42.48 42.43,43.07 39.99,43.07 39.81,42.89 CR2.GND | U1.68 38.52,38.85 38.67,39 | 29.24,28.83 29.61,29.2 U1.14 | U1.19 29.35,26.7 | C5.2 25.17,26.71 26.27,25.6 28.12,25.6
  Top 0.254: 38.67,39 42.02,39 43.04,39 | 42.02,38.98 42.02,37.94 | C4.1 26.19,33.97 28.36,33.97 28.36,32.52 29.68,31.2 29.83,31.2 | U1.49 45.29,30.2 v45.93,29.57 | U$16.1 MOLEX_SL_6PIN.1 21.4,76.03 22.03,76.67 90.61,76.67 91.25,76.03 U$50.1 | MOELX_SL_6PIN_1.1 U$22.1 | 28.12,25.6 28.25,25.6 29.35,26.7 29.24,26.81 29.24,28.83
  Top 0.762: U$24.1 64.58,27.77
  Top 0.813: 54.04,15.18 51.61,12.75
  Top 1.016: PS1.GND_2 54.04,15.18 | 64.58,27.77 63.94,28.41 54.42,28.41 53.86,27.85 53.66,25.87 | MOLEX_SL_2PIN.2 U$24.1
  Bottom 0.203: 45.93,29.87 v45.93,29.57
  Bottom 0.254: v43.01,38.93 42.38,38.29 42.38,31.15 42.84,30.7 45.1,30.7 45.93,29.87
  pour Top (no thermals): 51.24,26.63 54.29,26.63 54.29,21.81 53.02,21.81 53.02,23.84 51.5,25.36 51.24,25.36
  pour Top (no thermals): 24.32,26.89 24.32,23.33 25.59,22.06 26.86,22.06 26.86,25.36 26.61,25.62 26.1,25.62 25.59,26.12 25.59,26.89
  pour Top (no thermals): 25.59,22.82 25.59,22.06 28.89,18.76 30.16,18.76 30.16,20.54 28.89,21.81 27.88,21.81 26.86,22.82
  pour Top (no thermals): 25.59,33.24 17.72,33.24 17.72,26.38 24.83,26.38 24.83,27.39 24.57,27.65 18.99,27.65 18.99,31.97 25.34,31.97 25.59,32.22
  pour Top (no thermals): 28.46,19.29 28.46,13.93 33.64,8.75 51.52,8.75 52.34,9.56 52.34,13.4 52.11,13.63 50.99,13.63 50.81,13.45 50.81,9.69 40.83,9.69 40.4,10.12 40.4,13.25 40.5,13.35 35.01,13.35 33.95,14.41 31.81,14.41 30.09,16.14 30.09,19.11 29.91,19.29
  pour Top (no thermals): 35.19,20.23 40.55,20.23 40.91,19.88 40.91,18.43 40.75,18.28 37.43,18.28 36.66,19.04 35.17,19.04 35.14,19.01 35.14,20.18
  pour Bottom: 7.43,8.09 7.43,65.24 71.56,65.24 71.56,20.15 91.88,20.15 91.88,8.09
GND_6820  (via drill 0.4)
  Top 0.203: U2.14 U2.13
  Top 0.254: R6.P$2 92.52,60.94 92.52,69.05 91.78,69.79 GND.1 | v81.72,59.52 81.06,58.86 U2.1
  Bottom 1.27: v80.45,49.36 80.45,55.08 81.72,56.35 v81.72,59.52
  pour Top: 76.64,76.14 76.64,42.38 93.79,42.38 93.79,76.14
GND_CONTACTOR
  Top 1.27: J8.1 U$41.1 15.05,59.32 15.48,58.89 18.77,58.89 SW1.SOURCE
GPIO_53
  Top 0.254: MOLEX_SL_3PIN.6 U$28.1 82.99,24.6 81.72,25.87 81.72,31.58 81.09,32.22 46.8,32.22 46.78,32.2 U1.53
GPIO_54
  Top 0.254: MOLEX_SL_3PIN.5 U$29.1 82.99,27.14 82.36,27.77 82.36,32.22 81.72,32.85 46.8,32.85 46.64,32.7 U1.54
GPIO_55
  Top 0.254: MOLEX_SL_3PIN.4 U$30.1 83.63,29.68 82.99,30.31 82.99,32.85 82.36,33.49 46.16,33.49 45.87,33.2 U1.55
GPIO_58
  Top 0.254: MOLEX_SL_3PIN.3 U$31.1 84.26,32.22 83.63,32.85 83.63,34.12 83.01,34.74 45.51,34.74 45.47,34.7 U1.58
GPIO_59
  Top 0.254: U1.59 83.82,35.2 84.26,34.76 U$32.1 MOLEX_SL_3PIN.2
GPIO_60
  Top 0.254: U1.60 82.66,35.7 82.99,36.03 82.99,36.66 83.63,37.3 U$33.1 MOLEX_SL_3PIN.1
IBIAS
  Top 0.203: U2.16 85.43,59.7 85.41,59.73 85.41,60.1 86.04,60.73 R5.P$1
ICMP
  Top 0.203: R5.P$2 90.17,60.73 87.65,58.21 R6.P$1
  Top 0.254: U2.15 85.45,57.94 87.52,57.94 R6.P$1
IM
  Top 0.254: U2.10 86.87,55.42 87.76,54.53 87.76,54.51 88.98,53.29 R8.P$2 88.98,52.9 89.98,51.9 93.15,51.9 93.79,52.54 93.79,74.13 95.83,76.17 102.93,76.17 T1.10
IM_OUT
  Top 0.254: R13.P$2 103.06,52.37 97.08,46.38 90.17,46.38 J1.2 U$43.1
IP  (via drill 0.4)
  Top 0.254: U2.11 88.46,55.92 R7.P$1 90.19,57.11 92.65,57.11 93.15,57.62 93.15,74.76 v93.71,75.32 | T1.12 97.57,75.18 v96.27,75.18
  Bottom 0.254: v96.27,75.18 93.85,75.18 v93.71,75.32
IP_OUT
  Top 0.254: R11.P$1 96.33,51.59 93.47,48.73 J1.1 U$42.1
JTAG_CLK
  Top 0.254: U1.75 35.02,45.11 36.74,46.82 58.86,46.82 59.4,47.36 59.4,60.06 U$38.1 MOLEX_SL_5PIN.1
JTAG_IN
  Top 0.254: U1.73 36.02,44.1 36.84,44.92 63.94,44.92 64.58,45.55 U$36.1 MOLEX_SL_5PIN.3
JTAG_MODE
  Top 0.254: U1.74 35.52,44.57 36.51,45.55 61.4,45.55 62.04,46.19 U$37.1 MOLEX_SL_5PIN.2
JTAG_OUT
  Top 0.254: U1.72 36.52,43.84 36.97,44.28 66.48,44.28 67.12,44.92 U$35.1 MOLEX_SL_5PIN.4
JTAG_SEL
  Top 0.152: 37.05,43.65 37.02,43.63
  Top 0.254: 37.05,43.65 69.02,43.65 69.66,44.28 U$34.1 MOLEX_SL_5PIN.5 | 37.02,43.63 U1.71
MISO_IN  (via drill 0.4)
  Top 0.254: v80.65,60.79 80.71,60.86 R4.P$1 82.57,61.64 83.63,62.7 84.26,62.7 84.9,63.33 MISO.1 | U2.3 79.6,57.42 79.08,57.94 v79.08,58.25
  Bottom 0.254: v80.65,60.79 79.82,60.79 79.18,60.16 79.18,58.25 v79.08,58.25
MOSI_IN
  Top 0.254: U2.2 80.28,57.92 79.76,58.45 79.76,62 80.45,62.7 81.09,62.7 81.72,63.33 MOSI.1
N$1
  Top 0.152: U1.20 29.25,24.79 C7.1
  pour Top (no thermals): 29.91,26.12 28.64,24.85 28.64,23.84 29.91,23.84 31.43,25.36 31.43,26.12
N$3  (via drill 0.4)
  Top 0.254: R7.P$2 90.73,53.49 R8.P$1 92.52,53.24 v92.52,54.44 | v88.27,51.78 88.27,52.03 86.93,53.37 86.93,53.41 C13.P$2
  Bottom 0.254: v88.27,51.78 88.27,51.71 89.34,50.63 91.88,50.63 92.52,51.27 v92.52,54.44
N$11
  Top 0.254: R10.P$1 102.68,56.72 102.68,59.28 T1.3
N$12
  Top 0.203: U1.69
  Top 0.254: U1.69 38.03,39.2 38.39,39.56 41.31,39.56 CR2.IN
N$13
  Top 0.254: U1.70 37.52,40.32 CR2.OUT
N$19
  Top 0.152: CR1.P$2 27,30.97 C4.2
  Top 0.203: CR1.P$2 27.77,30.2 U1.12
  pour Top (no thermals): 26.1,31.2 26.35,31.46 26.35,33.24 26.61,32.98 27.62,32.98 27.62,32.22 29.15,30.7 29.15,30.19 26.1,30.19
N$20
  Top 0.152: U1.13 28.15,29.7 26.96,28.51 | 26.96,28.51 CR1.P$3 | C5.1 27.05,28.43 26.96,28.51
  pour Top (no thermals): 28.82,29.68 28.82,27.57 27.62,26.38 26.61,26.38 26.61,27.65 26.1,28.16 26.1,29.68
N$21
  Top 0.254: T1.1 98.93,59.05 96.47,56.59 R9.P$2
N$30
  Top 1.27: R3.2 12.2,22.82 | SW1.DRAIN 15.93,34.86 15.93,26.55 12.2,22.82 | SW2.GATE 8.78,26.25 12.2,22.82
N$31
  Top 0.152: U1.8 29.56,32.2 29.55,32.19 29.12,32.63 29.12,34.23 28.8,34.55 SW1.GATE
N$40
  Top 0.61: R10.P$2 R12.P$2 | R13.P$1 102.7,54.06 R12.P$2
  Top 0.813: R12.P$2
N$41
  Top 0.61: R12.P$1 98.16,54.43 R11.P$2 | 98.47,54.12 R9.P$1
  Top 0.813: R12.P$1 98.47,54.12
SCK_IN
  Top 0.254: U2.4 78.87,56.92 78.1,57.68 78.1,69.24 SCK.1
UCA0_CLK  (via drill 0.4)
  Top 0.152: U1.36 40.02,22.5 39.48,21.96 v39.45,21.96
  Top 0.254: MOELX_SL_6PIN_1.5 U$18.1 50.61,56.35 49.97,55.71 41.08,55.71 30.29,44.92 v30.29,43.01 | v25.21,42.38 25.84,43.01 v27.75,43.01
  Bottom 0.254: v39.45,21.96 40.01,22.52 40.01,26.08 25.21,40.88 v25.21,42.38 | v27.75,43.01 v30.29,43.01
UCA0_CS  (via drill 0.4)
  Top 0.254: U1.34 39.02,23.41 38.31,22.69 37.91,22.69 37.48,22.26 v37.48,21.96 | MOELX_SL_6PIN_1.2 U$21.1
  Bottom 0.254: U$21.1 42.99,58.25 42.35,57.62 37.91,57.62 37.41,58.12 37.41,60.74 36.59,61.57 20.82,61.57 19.99,60.74 19.99,59.58 21.76,57.81 21.76,42.1 39.03,24.82 39.03,23.51 38.54,23.03 38.54,22.69 37.91,22.69 37.48,22.26 v37.48,21.96
UCA0_MISO  (via drill 0.4)
  Top 0.254: U1.41 44.46,25.63 v44.46,24.78 | MOELX_SL_6PIN_1.3 U$20.1 | v45.53,52.54 v45.53,54.59
  Bottom 0.254: v44.46,24.78 42.66,26.58 42.66,29.38 34.18,37.86 34.18,45.94 40.14,51.9 44.89,51.9 v45.53,52.54 | v45.53,54.59 U$20.1
UCA0_MOSI  (via drill 0.4)
  Top 0.152: U1.40 42.08,24.33
  Top 0.254: 42.08,24.33 43.55,22.86 v43.55,21.93 | MOELX_SL_6PIN_1.4 U$19.1
  Bottom 0.254: v43.55,21.93 42.05,23.43 42.05,28.77 33.46,37.35 33.46,46.82 40.45,53.81 46.16,53.81 48.07,55.71 U$19.1
UCB0_CLK  (via drill 0.4)
  Top 0.152: 41.54,24.46 41.52,24.44 U1.39 | 42.53,22.01 v42.53,21.96
  Top 0.203: 41.54,24.46 41.54,23
  Top 0.254: 42.53,22.01 41.54,23 | U$12.1 MOLEX_SL_6PIN.5 31.56,73.49 32.19,74.13 77.91,74.13 78.55,73.49 U$46.1
  Bottom 0.254: v42.53,21.96 41.57,22.92 41.57,28.13 31.56,38.14 U$12.1
UCB0_CS  (via drill 0.4)
  Top 0.152: 39.52,23.01
  Top 0.203: U1.35 39.52,23.01 | 39.52,23.01 v38.44,21.93
  Top 0.254: U$15.1 MOLEX_SL_6PIN.2 23.94,75.4 24.57,76.03 87.44,76.03 88.07,75.4 U$49.1
  Bottom 0.203: v38.44,21.93 39.51,23
  Bottom 0.254: 39.51,23 39.51,25.54 23.94,41.11 U$15.1
UCB0_MISO  (via drill 0.4)
  Top 0.152: U1.38 41.03,22.46 | v41.54,21.96 v41.53,21.96
  Top 0.254: v41.53,21.96 41.03,22.46 | U$14.1 MOLEX_SL_6PIN.3 26.48,74.76 27.11,75.4 84.26,75.4 84.9,74.76 U$48.1
  Bottom 0.254: v41.54,21.96 41.03,22.47 41.03,27.52 26.48,42.08 U$14.1
UCB0_MOSI  (via drill 0.4)
  Top 0.152: U1.37 v40.52,21.96 v40.53,21.96
  Top 0.254: v29.02,38.32 U$13.1 MOLEX_SL_6PIN.4 29.02,74.13 29.65,74.76 81.09,74.76 81.72,74.13 U$47.1
  Bottom 0.254: v40.53,21.96 40.53,26.81 v29.02,38.32
USCIA1_RX
  Top 0.152: U1.52
  Top 0.254: U1.52 79.06,31.7 80.45,30.31 80.45,16.34 81.09,15.71 MOLEX_SL_4PIN.2 U$26.1
USCIA1_TX
  Top 0.254: U$25.1 MOLEX_SL_4PIN.3 80.45,13.17 79.82,13.8 79.82,29.68 78.3,31.2 U1.51
VADJ
  pour Top (no thermals): 45.43,16.04 45.43,10.5 45.73,10.2 47.97,10.2 49.34,11.57 49.34,13.5 46.8,16.04

### Text on the board
tPlace: T1 | R4 | U2 | C12 | C10 | C13 | CR2 | SW1 | SW2 | C4 | C2 | CR1 | C5 | C1 | R3 | C7 | C3 | C6 | C8 | PS2 | R2 | C9 | R1 | PS1
tNames: CONT_OUT | CONT_IN | CONT_GND | GND | UCB0_CS | UCB0_MISO | UCB0_MOSI | UCB0_CLK | +5V | GND | UCA0_CS | UCA0_MISO | UCA0_MOSI | UCA0_CLK | +5V | JTAG_CLK | JTAG_MOD | JTAG_IN | JTAG_OUT | JTAG_SEL | GPIO_60 | GPIO_8 | GPIO_59 | GPIO_55 | GPIO_55 | GND | 12V | GPIO_54 | GPIO_53 | +5V | USCIA1(RX) | USCIA1(TX) | GND